# EasyEDA schematic SCH_SmartHome-Breakout_2025-02-25.json
TITLE: Sheet_1; REV: 1.0; Date: 2024-09-25; Sheet: 1/1; Drawn By: metelmann; Company: Your Company
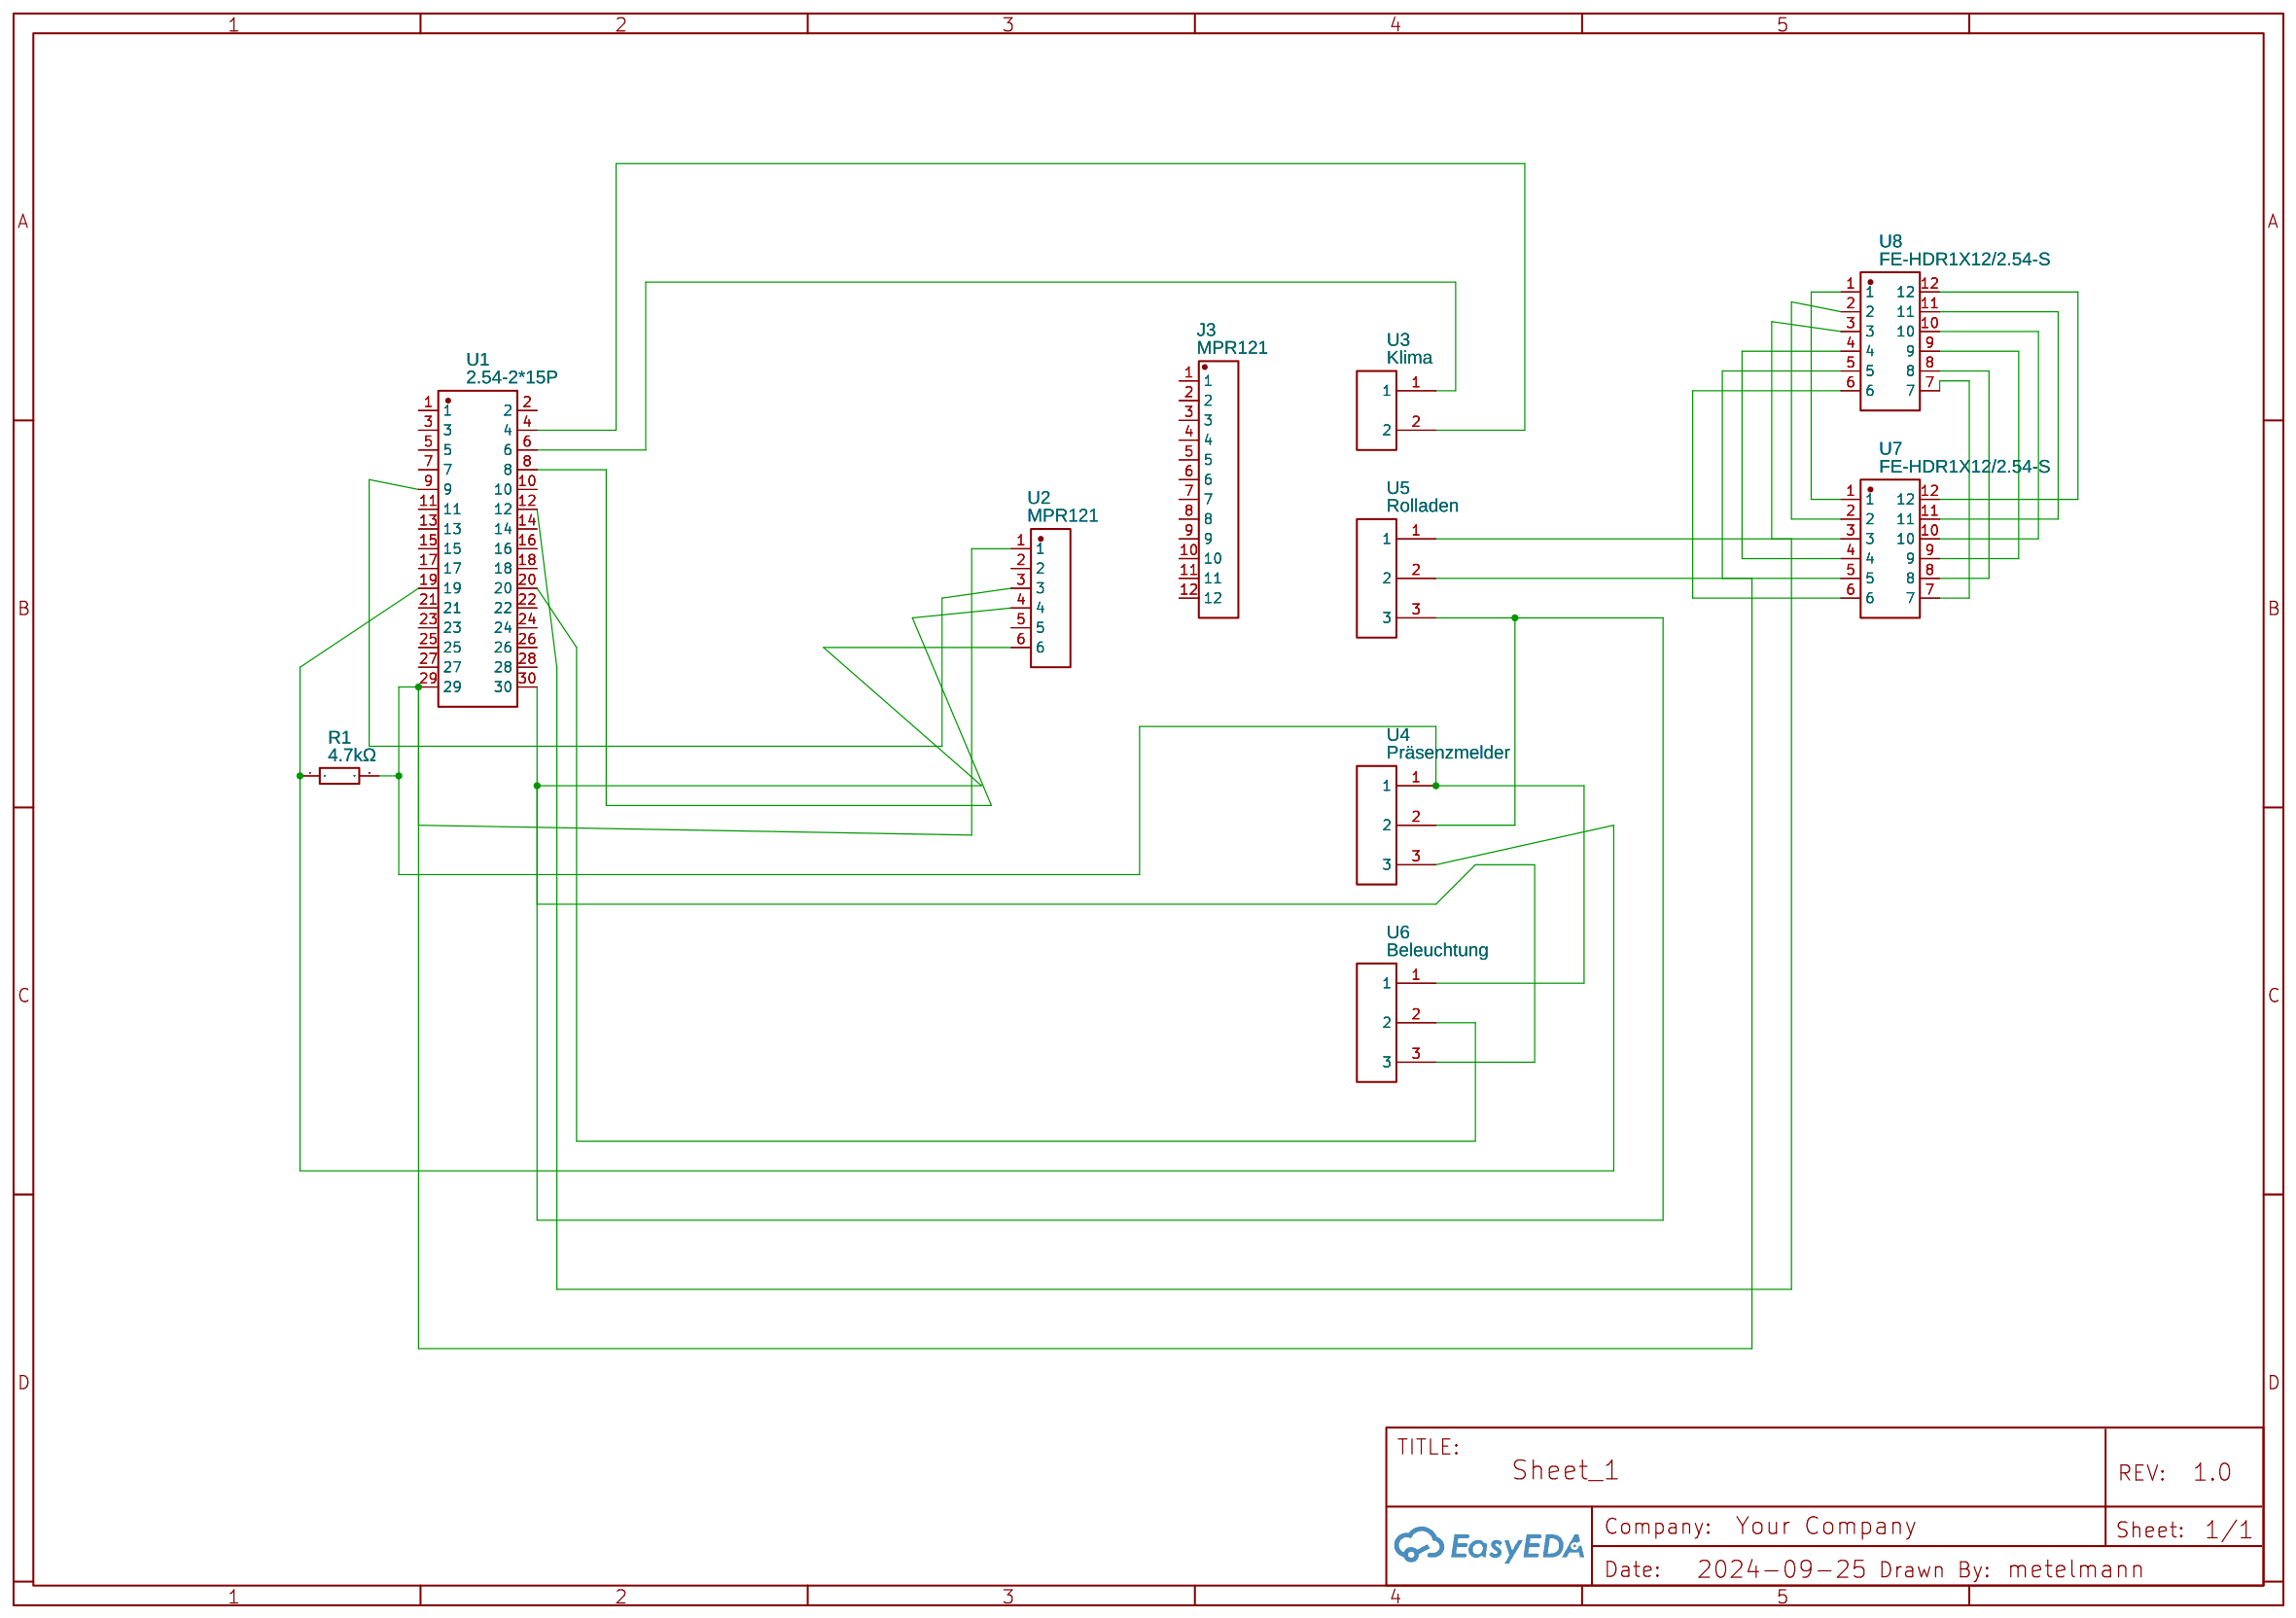
[diagram p0: schematic sheet]

## Parts
J3  MPR121  [HDR-TH_15P-P2.54-V-M]
R1  4.7kΩ  [RES-TH_BD2.3-L6.5-P10.50-D0.5]
U1  2.54-2*15P  [HDR-TH_30P-P2.54-V-F-R2-C15-S2.54]
U2  MPR121  [HDR-TH_6P-P2.54-V-M]
U3  Klima  [2PIN CONNECTOR]
U4  Präsenzmelder  [3PIN CONNECTOR]
U5  Rolladen  [3PIN CONNECTOR]
U6  Beleuchtung  [3PIN CONNECTOR]
U7  FE-HDR1X12/2.54-S  [HDR-TH_12P-P2.54_FE-HDR1X12-2.54-S]
U8  FE-HDR1X12/2.54-S  [HDR-TH_12P-P2.54_FE-HDR1X12-2.54-S]

## Library data of the parts
J3 = HeadersPins1x12P2.54mm: Contributor: pabloiglesiasRSE
R1 = MF1/4W-4.7KΩ±1% T52 MINI: Contributor: LCSC; Supplier: LCSC; Supplier Part: C119339; Manufacturer: CCO(千志电子); Manufacturer Part: MF1/4W-4.7KΩ±1% T; JLCPCB Part Class: Extended Part
U1 = 2.54-2*15P: Contributor: lcsc; Supplier: LCSC; Supplier Part: C5337168; Manufacturer: BOOMELE(博穆精密); JLCPCB Part Class: Extended Part
U2 = 2.54-1*6: Contributor: lcsc; Supplier: LCSC; Supplier Part: C5156615; Manufacturer: ZHOURI(洲日); JLCPCB Part Class: Extended Part
U3 = 2pin connector: Contributor: iliazark
U4-U6 = 3pin connector: Contributor: iliazark
U7 U8 = FE-HDR1X12/2.54-S: Contributor: lcsc; Supplier: LCSC; Supplier Part: C9900013702; Manufacturer: null; Manufacturer Part: Fe-HDR1X12/2.54-S; JLCPCB Part Class: Extended Part

## Nets
Net-(R1-1): R1.1 U1.19 U4.3
Net-(R1-2): R1.2 U1.29 U2.1 U4.1 U5.2 U6.1
Net-(U1-4): U1.4 U3.2
Net-(U1-6): U1.6 U3.1
Net-(U1-8): U1.8 U2.4
Net-(U1-9): U1.9 U2.3
Net-(U1-12): U1.12 U5.1
Net-(U1-20): U1.20 U6.2
Net-(U1-30): U1.30 U2.6 U4.2 U5.3 U6.3
Net-(U7-1): U7.1 U8.1
Net-(U7-2): U7.2 U8.2
Net-(U7-3): U7.3 U8.3
Net-(U7-4): U7.4 U8.4
Net-(U7-5): U7.5 U8.5
Net-(U7-6): U7.6 U8.6
Net-(U7-7): U7.7 U8.7
Net-(U7-8): U7.8 U8.8
Net-(U7-9): U7.9 U8.9
Net-(U7-10): U7.10 U8.10
Net-(U7-11): U7.11 U8.11
Net-(U7-12): U7.12 U8.12

Not connected (* = marked no-connect by the designer): J3 1 2 3 4 5 6 7 8 9 10 11 12; U1 1 2 3 5 7 10 11 13 14 15 16 17 18 21 22 23 24 25 26 27 28; U2 2 5
